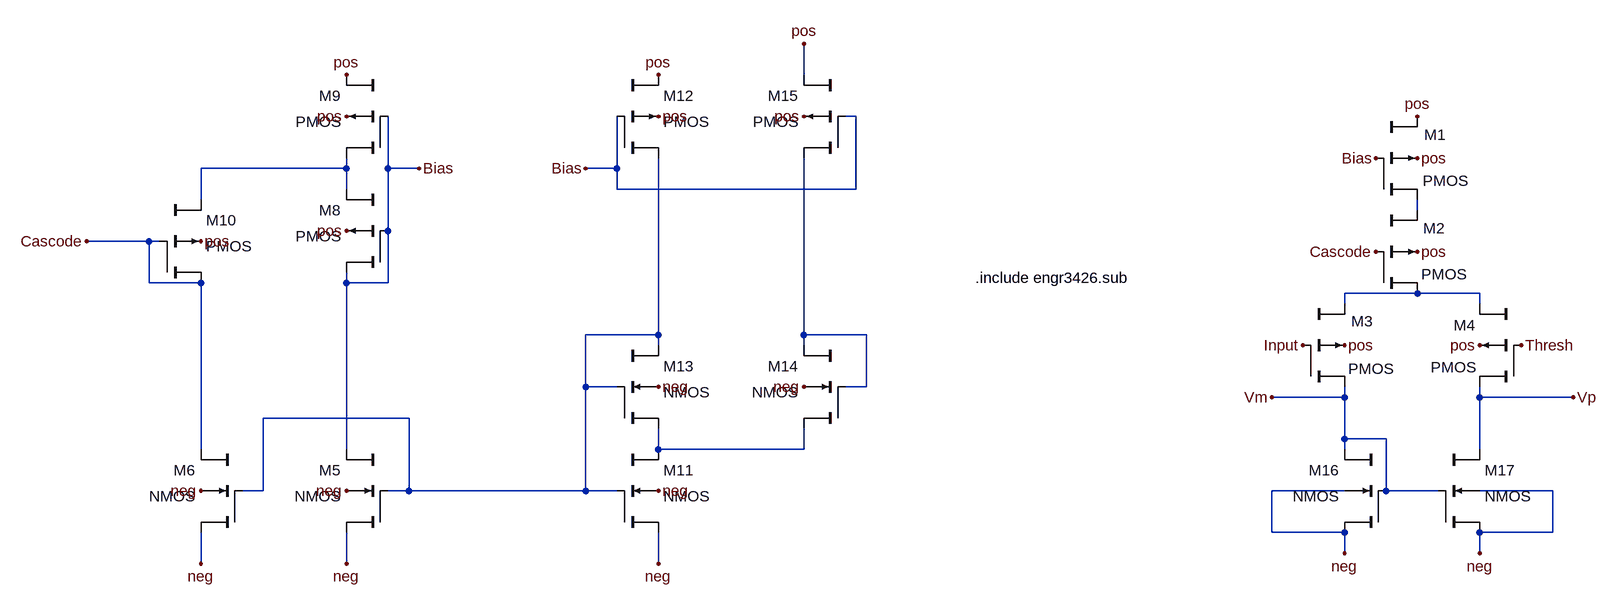
[diagram p0: schematic comparator_preamp_AmySym.asc]
comparator_preamp_AmySym.asc, the LTspice schematic file:
Version 4
SHEET 1 1144 1268
WIRE -736 -32 -736 -80
WIRE -656 32 -672 32
WIRE -1440 112 -1440 96
WIRE -1440 112 -1664 112
WIRE -1376 112 -1376 32
WIRE -1328 112 -1376 112
WIRE -1024 112 -1024 32
WIRE -1024 112 -1072 112
WIRE -1440 144 -1440 112
WIRE -1024 144 -1024 112
WIRE -656 144 -656 32
WIRE -656 144 -1024 144
WIRE -1664 160 -1664 112
WIRE 208 176 208 160
WIRE -1376 208 -1376 112
WIRE -1744 224 -1840 224
WIRE -1728 224 -1744 224
WIRE -1744 288 -1744 224
WIRE -1664 288 -1744 288
WIRE -1440 288 -1440 272
WIRE -1376 288 -1376 208
WIRE -1376 288 -1440 288
WIRE 208 304 96 304
WIRE 304 304 208 304
WIRE 96 320 96 304
WIRE 304 320 304 304
WIRE -960 368 -960 96
WIRE -960 368 -1072 368
WIRE -736 368 -736 96
WIRE -640 368 -736 368
WIRE -960 384 -960 368
WIRE -736 384 -736 368
WIRE -1072 448 -1072 368
WIRE -1024 448 -1072 448
WIRE -640 448 -640 368
WIRE -640 448 -672 448
WIRE 96 464 96 448
WIRE 96 464 -16 464
WIRE 304 464 304 448
WIRE 448 464 304 464
WIRE -1344 496 -1568 496
WIRE 96 528 96 464
WIRE 160 528 96 528
WIRE -1664 544 -1664 288
WIRE -1440 544 -1440 288
WIRE -960 544 -960 512
WIRE -736 544 -736 512
WIRE -736 544 -960 544
WIRE 96 544 96 528
WIRE 304 544 304 464
WIRE -1568 608 -1568 496
WIRE -1568 608 -1600 608
WIRE -1344 608 -1344 496
WIRE -1344 608 -1376 608
WIRE -1072 608 -1072 448
WIRE -1072 608 -1344 608
WIRE -1024 608 -1072 608
WIRE 96 608 -16 608
WIRE 160 608 160 528
WIRE 240 608 160 608
WIRE 416 608 304 608
WIRE -16 672 -16 608
WIRE 96 672 -16 672
WIRE 416 672 416 608
WIRE 416 672 304 672
WIRE 96 704 96 672
WIRE 304 704 304 672
WIRE -1664 720 -1664 672
WIRE -1440 720 -1440 672
WIRE -960 720 -960 672
FLAG 96 384 pos
FLAG 304 384 pos
FLAG 208 240 pos
FLAG 208 96 pos
FLAG 208 32 pos
FLAG 32 384 Input
FLAG 368 384 Thresh
FLAG 144 240 Cascode
FLAG 144 96 Bias
FLAG 448 464 Vp
FLAG -16 464 Vm
FLAG -1440 608 neg
FLAG -1664 608 neg
FLAG -1440 720 neg
FLAG -1664 720 neg
FLAG -1440 208 pos
FLAG -1440 32 pos
FLAG -1440 -32 pos
FLAG -1664 224 pos
FLAG -1840 224 Cascode
FLAG -1328 112 Bias
FLAG -960 608 neg
FLAG -960 720 neg
FLAG -960 32 pos
FLAG -960 -32 pos
FLAG -1072 112 Bias
FLAG -960 448 neg
FLAG -736 448 neg
FLAG -736 32 pos
FLAG -736 -80 pos
FLAG 96 704 neg
FLAG 304 704 neg
SYMBOL cktsym\\pmos4 208 96 R0
WINDOW 0 11 -36 Left 2
WINDOW 3 8 35 Left 2
SYMATTR InstName M1
SYMATTR Value2 l=4u w=16u
SYMBOL cktsym\\pmos4 208 240 R0
WINDOW 0 9 -36 Left 2
WINDOW 3 6 35 Left 2
SYMATTR InstName M2
SYMATTR Value2 l=.8u w=3.2u
SYMBOL cktsym\\pmos4 96 384 R0
WINDOW 0 10 -37 Left 2
WINDOW 3 6 36 Left 2
SYMATTR InstName M3
SYMATTR Value2 l=1u w=3u
SYMBOL cktsym\\pmos4 304 384 M0
WINDOW 0 6 -31 Left 2
WINDOW 3 5 34 Left 2
SYMATTR InstName M4
SYMATTR Value2 l=1u w=3u
SYMBOL cktsym\\nmos4 -1440 608 M0
SYMATTR InstName M5
SYMATTR Value2 l=4u w=0.8u
SYMBOL cktsym\\nmos4 -1664 608 M0
SYMATTR InstName M6
SYMATTR Value2 l=4u w=4u
SYMBOL cktsym\\pmos4 -1440 208 M0
SYMATTR InstName M8
SYMATTR Value2 l=1u w=16u
SYMBOL cktsym\\pmos4 -1440 32 M0
SYMATTR InstName M9
SYMATTR Value2 l=4u w=16u
SYMBOL cktsym\\pmos4 -1664 224 R0
SYMATTR InstName M10
SYMATTR Value2 l=4u w=16u
SYMBOL cktsym\\nmos4 -960 608 R0
SYMATTR InstName M11
SYMATTR Value2 l=4u w=4u
SYMBOL cktsym\\pmos4 -960 32 R0
SYMATTR InstName M12
SYMATTR Value2 l=4u w=3.2u
SYMBOL cktsym\\nmos4 -960 448 R0
SYMATTR InstName M13
SYMATTR Value2 l=4u w=16u
SYMBOL cktsym\\nmos4 -736 448 M0
SYMATTR InstName M14
SYMATTR Value2 l=4u w=4u
SYMBOL cktsym\\pmos4 -736 32 M0
SYMATTR InstName M15
SYMATTR Value2 l=4u w=16u
SYMBOL cktsym\\nmos4 96 608 M0
SYMATTR InstName M16
SYMATTR Value2 l=1.5u w=6u
SYMBOL cktsym\\nmos4 304 608 R0
SYMATTR InstName M17
SYMATTR Value2 l=1.5u w=6u
TEXT -472 280 Left 2 !.include engr3426.sub

The netlist it stands for:
* comparator_preamp_AmySym.asc
M1 N002 Bias pos pos PMOS l=4u w=16u
M2 N003 Cascode N002 pos PMOS l=.8u w=3.2u
M3 Vm Input N003 pos PMOS l=1u w=3u
M4 Vp Thresh N003 pos PMOS l=1u w=3u
M5 Bias N004 neg neg NMOS l=4u w=0.8u
M6 Cascode N004 neg neg NMOS l=4u w=4u
M8 Bias Bias N001 pos PMOS l=1u w=16u
M9 N001 Bias pos pos PMOS l=4u w=16u
M10 Cascode Cascode N001 pos PMOS l=4u w=16u
M11 N006 N004 neg neg NMOS l=4u w=4u
M12 N004 Bias pos pos PMOS l=4u w=3.2u
M13 N004 N004 N006 neg NMOS l=4u w=16u
M14 N005 N005 N006 neg NMOS l=4u w=4u
M15 N005 Bias pos pos PMOS l=4u w=16u
M16 Vm Vm neg neg NMOS l=1.5u w=6u
M17 Vp Vm neg neg NMOS l=1.5u w=6u
.model NMOS NMOS
.model PMOS PMOS
.lib standard.mos
.include engr3426.sub
.backanno
.end